# EAGLE design ARD_SHIELD_WIRED (EAGLE 7.6.0)
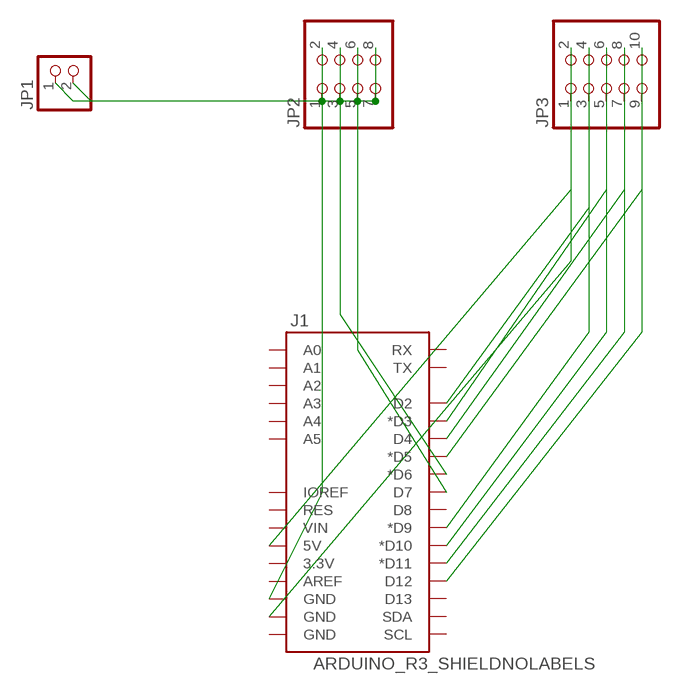
[diagram p0: schematic, sheet 1]

## Parts
J1  ARDUINO_R3_SHIELDNOLABELS  [UNO_R3_SHIELD_NOLABELS]
JP1  PINHD-1X2  [1X02]
JP2  PINHD-2X4  [2X04]
JP3  PINHD-2X5  [2X05]

## Nets
N$1: J1.GND@2(GND) JP1.2 JP2.1 JP2.2
N$2: J1.D6(*D6) JP2.3 JP2.4
N$3: J1.D7 JP2.5 JP2.6
N$4: JP1.1 JP2.7 JP2.8
N$5: J1.5V JP3.1
N$6: J1.GND@1(GND) JP3.2
N$7: J1.D9(*D9) JP3.3
N$8: J1.D10(*D10) JP3.5
N$9: J1.D11(*D11) JP3.7
N$10: J1.D12 JP3.9
N$11: J1.D2 JP3.4
N$12: J1.D3(*D3) JP3.6
N$13: J1.D4 JP3.8
N$14: J1.D5(*D5) JP3.10
Unconnected: J1.3.3V J1.A0 J1.A1 J1.A2 J1.A3 J1.A4 J1.A5 J1.AREF J1.D8 J1.D13 J1.GND@0(GND) J1.IOREF J1.RES J1.RX J1.SCL J1.SDA J1.TX J1.VIN

## Library data of the parts
J1 = SparkFun-Boards:ARDUINO_R3_SHIELD: Shield form compatible with the Arduino Uno R3.
JP1 = pinhead:PINHD-1X2: PIN HEADER
JP2 = pinhead:PINHD-2X4: PIN HEADER
JP3 = pinhead:PINHD-2X5: PIN HEADER

## Net classes
0 default: width 0.508 mm, drill 0.508 mm, clearance 0.508 mm

## Board
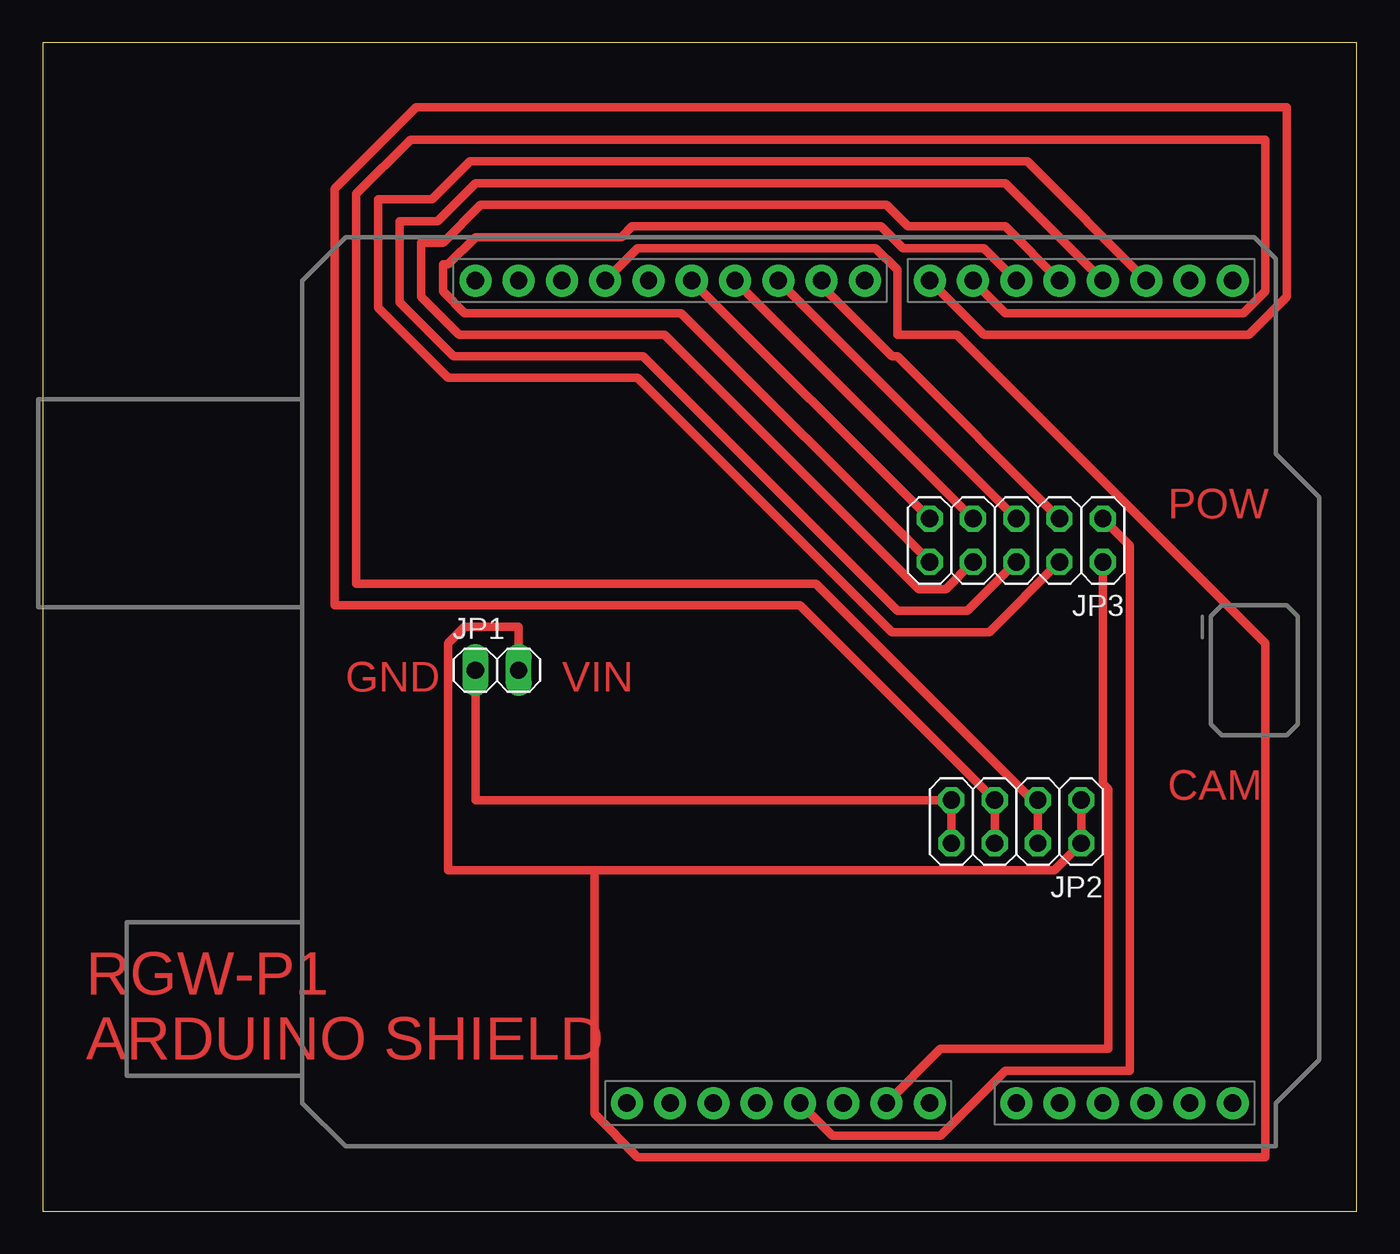
[diagram p1: board, top side]

Size 77.14 x 68.57 mm. Coordinates in mm from the lower left corner, seen from the top.
Outline: 0,0 77.14,0 77.14,68.57 0,68.57 0,0
Copper layers (1*16): Top 0.035mm / dielectric 1.5mm / Bottom 0.035mm
Design rules "default": minimum track width 10mil, minimum drill 24mil, track to track 8mil, track to pad 8mil, pad to pad 8mil, via to via 8mil, smd to smd 8mil, copper to edge 40mil, drill to drill 8mil, minimum pad ring 10mil, minimum via ring 8mil, stop-mask expansion 4mil, vias tented up to drill 0mil, thermal gap 10mil

### Footprints (pad centres in the part's own frame; a part is rotated, then mirrored left to right if it is on the bottom)
UNO_R3_SHIELD_NOLABELS = drill 1.016 pad 1.88: 3.3V 50.8,26.67; 5V 50.8,29.21; A0 50.8,41.91; A1 50.8,44.45; A2 50.8,46.99; A3 50.8,49.53; A4 50.8,52.07; A5 50.8,54.61; AREF 2.54,15.24; D2 2.54,49.53; D3 2.54,46.99; D4 2.54,44.45; D5 2.54,41.91; D6 2.54,39.37; D7 2.54,36.83; D8 2.54,33.02; D9 2.54,30.48; D10 2.54,27.94; D11 2.54,25.4; D12 2.54,22.86; D13 2.54,20.32; GND@0 50.8,31.75; GND@1 50.8,34.29; GND@2 2.54,17.78; IOREF 50.8,21.59; NC 50.8,19.05; RES 50.8,24.13; RX 2.54,54.61; SCL 2.54,10.16; SDA 2.54,12.7; TX 2.54,52.07; VIN 50.8,36.83
1X02 = drill 1.016 long: 1 -1.27,0; 2 1.27,0
2X04 = drill 1.016 octagon: 1 -3.81,-1.27; 2 -3.81,1.27; 3 -1.27,-1.27; 4 -1.27,1.27; 5 1.27,-1.27; 6 1.27,1.27; 7 3.81,-1.27; 8 3.81,1.27
2X05 = drill 1.016 octagon: 1 -5.08,-1.27; 2 -5.08,1.27; 3 -2.54,-1.27; 4 -2.54,1.27; 5 0,-1.27; 6 0,1.27; 7 2.54,-1.27; 8 2.54,1.27; 9 5.08,-1.27; 10 5.08,1.27

### Placement (x,y rotation side)
J1  15.24,57.15 270 top
JP1  26.67,31.75 0 top
JP2  57.15,22.86 180 top
JP3  57.15,39.37 180 top

### Tracks (layer width: path | path; a pad name or v marks a point on that pad's centre or on a via)
N$1
  Top 0.508: JP2.1 JP2.2 59.37,20 32.39,20 | JP1.2 27.94,34.29 24.77,34.29 23.81,33.34 23.81,20 32.39,20 | J1.GND@2 34.93,56.52 48.9,56.52 50.16,55.25 50.16,51.44 53.66,51.44 71.75,33.34 71.75,3.17 34.93,3.17 32.39,5.72 32.39,20
N$2
  Top 0.508: JP2.4 JP2.3 58.1,24.13 45.4,36.83 18.41,36.83 18.41,59.69 21.59,62.87 71.75,62.87 71.75,53.98 70.48,52.71 56.52,52.71 J1.D6
N$3
  Top 0.508: JP2.6 JP2.5 44.45,35.56 17.15,35.56 17.15,60.01 21.91,64.77 73.03,64.77 73.03,53.66 70.8,51.44 55.25,51.44 J1.D7
N$4
  Top 0.508: JP1.1 25.4,24.13 JP2.7 JP2.8
N$5
  Top 0.508: JP3.1 63.82,39.05 63.82,8.25 56.52,8.25 52.7,4.44 46.36,4.44 J1.5V
N$6
  Top 0.508: JP3.2 62.23,25.08 62.55,24.76 62.55,9.52 52.7,9.52 J1.GND@1
N$7
  Top 0.508: JP3.3 50.16,50.16 49.85,50.16 45.72,54.29 J1.D9
N$8
  Top 0.508: J1.D10 JP3.5
N$9
  Top 0.508: J1.D11 JP3.7
N$10
  Top 0.508: J1.D12 JP3.9
N$11
  Top 0.508: JP3.4 55.56,33.97 49.85,33.97 34.93,48.9 23.81,48.9 19.69,53.02 19.69,59.37 22.86,59.37 25.08,61.6 57.79,61.6 J1.D2
N$12
  Top 0.508: JP3.6 54.29,35.24 50.16,35.24 35.24,50.16 24.13,50.16 20.95,53.34 20.95,58.1 23.18,58.1 25.4,60.32 56.52,60.32 J1.D3
N$13
  Top 0.508: JP3.8 53.02,36.51 51.44,36.51 36.51,51.44 24.45,51.44 22.23,53.66 22.23,56.83 23.49,56.83 25.72,59.05 49.53,59.05 50.8,57.79 56.52,57.79 J1.D4
N$14
  Top 0.508: JP3.10 37.47,52.71 24.77,52.71 23.49,53.98 23.49,55.56 23.81,55.56 25.4,57.15 33.97,57.15 34.61,57.79 49.21,57.79 50.48,56.52 55.25,56.52 J1.D5

### Text on the board
Top: POW | GND | VIN | CAM | RGW-P1 / ARDUINO SHIELD